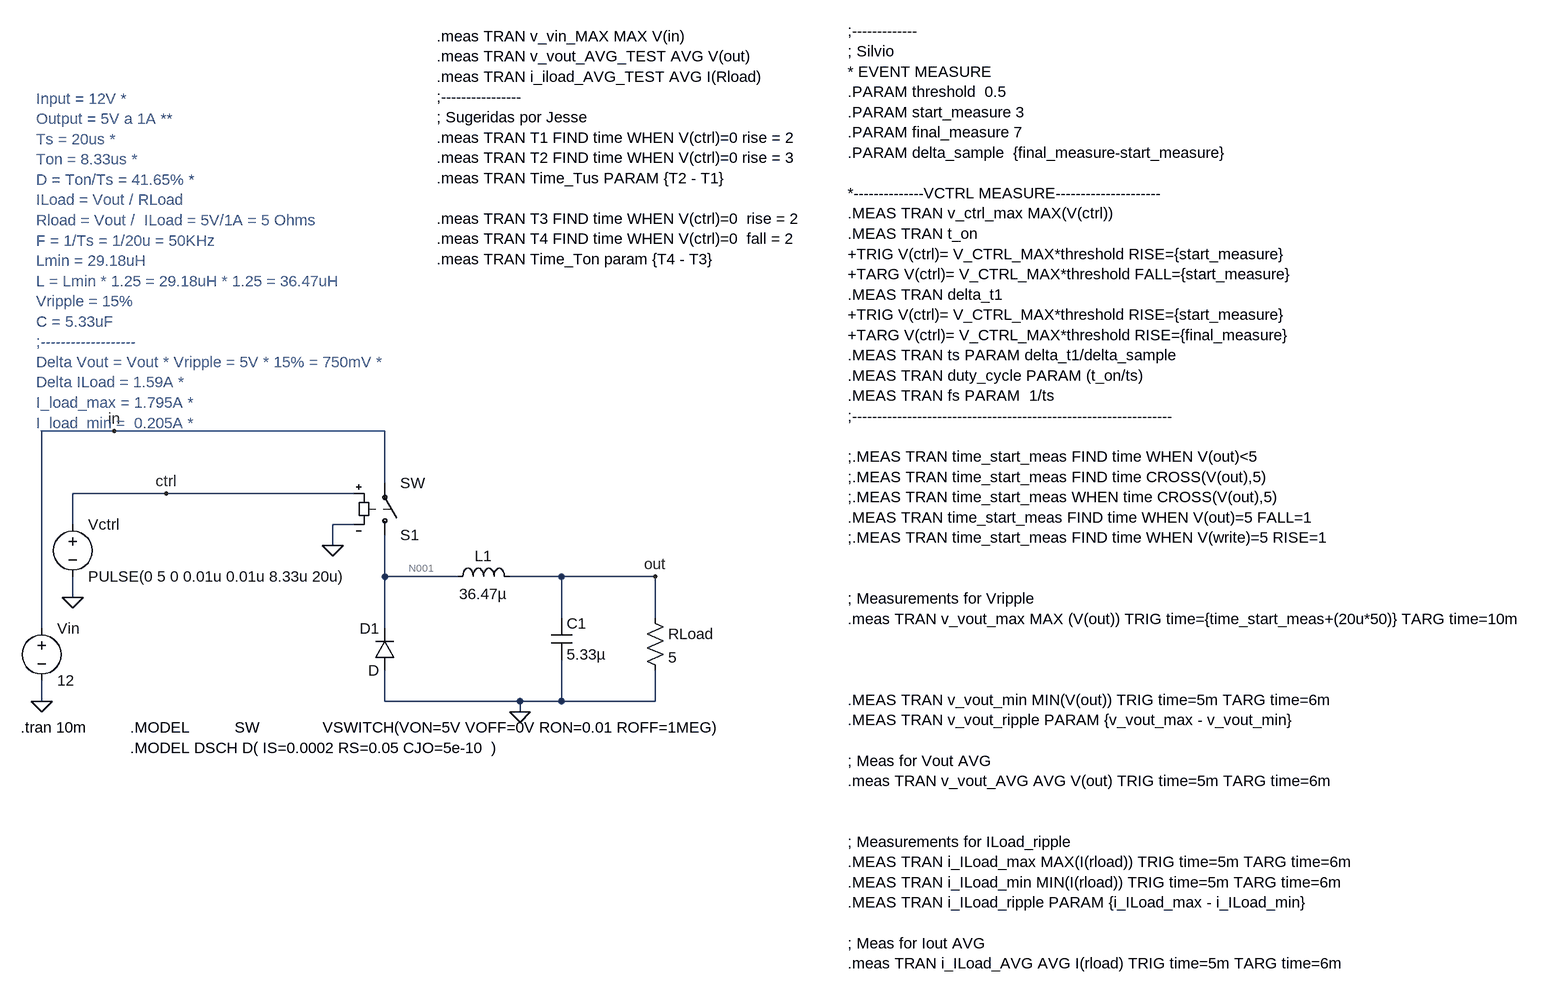
[diagram p0: schematic Buck_Converter_Learning.asc]
Buck_Converter_Learning.asc, the LTspice schematic file:
Version 4
SHEET 1 2132 820
WIRE -160 -144 -272 -144
WIRE 256 -144 -160 -144
WIRE 256 -64 256 -144
WIRE -80 -48 -224 -48
WIRE 208 -48 -80 -48
WIRE -224 0 -224 -48
WIRE 208 0 176 0
WIRE 176 32 176 0
WIRE 256 80 256 16
WIRE 368 80 256 80
WIRE 528 80 448 80
WIRE 672 80 528 80
WIRE -224 112 -224 80
WIRE 528 144 528 80
WIRE 672 144 672 80
WIRE -272 160 -272 -144
WIRE 256 160 256 80
WIRE -272 272 -272 240
WIRE 256 272 256 224
WIRE 464 272 256 272
WIRE 528 272 528 208
WIRE 528 272 464 272
WIRE 672 272 672 224
WIRE 672 272 528 272
WIRE 464 288 464 272
FLAG -272 272 0
FLAG 464 288 0
FLAG -224 112 0
FLAG 176 32 0
FLAG -160 -144 in
FLAG 672 80 out
FLAG -80 -48 ctrl
SYMBOL voltage -272 144 R0
WINDOW 123 0 0 Left 0
WINDOW 39 0 0 Left 0
SYMATTR InstName Vin
SYMATTR Value 12
SYMBOL sw 256 32 M180
SYMATTR InstName S1
SYMBOL diode 272 224 R180
WINDOW 0 24 64 Left 2
WINDOW 3 24 0 Left 2
SYMATTR InstName D1
SYMBOL ind 352 96 R270
WINDOW 0 32 56 VTop 2
WINDOW 3 5 56 VBottom 2
SYMATTR InstName L1
SYMATTR Value 36.47µ
SYMBOL cap 512 144 R0
SYMATTR InstName C1
SYMATTR Value 5.33µ
SYMBOL res 656 128 R0
SYMATTR InstName RLoad
SYMATTR Value 5
SYMBOL voltage -224 -16 R0
WINDOW 123 0 0 Left 0
WINDOW 39 0 0 Left 0
SYMATTR InstName Vctrl
SYMATTR Value PULSE(0 5 0 0.01u 0.01u 8.33u 20u)
TEXT -280 -656 Left 2 ;Input = 12V *\nOutput = 5V a 1A **\nTs = 20us *            \nTon = 8.33us *\nD = Ton/Ts = 41.65% *\nILoad = Vout / RLoad\nRload = Vout /  ILoad = 5V/1A = 5 Ohms\nF = 1/Ts = 1/20u = 50KHz\nLmin = 29.18uH\nL = Lmin * 1.25 = 29.18uH * 1.25 = 36.47uH\nVripple = 15%\nC = 5.33uF\n;-------------------\nDelta Vout = Vout * Vripple = 5V * 15% = 750mV *\nDelta ILoad = 1.59A *\nI_load_max = 1.795A *\nI_load_min =  0.205A *
TEXT -304 312 Left 2 !.tran 10m
TEXT -136 312 Left 2 !.MODEL          SW              VSWITCH(VON=5V VOFF=0V RON=0.01 ROFF=1MEG)\n.MODEL DSCH D( IS=0.0002 RS=0.05 CJO=5e-10  )
TEXT 336 -752 Left 2 !.meas TRAN v_vin_MAX MAX V(in)\n.meas TRAN v_vout_AVG_TEST AVG V(out)\n.meas TRAN i_iload_AVG_TEST AVG I(Rload)\n;----------------\n; Sugeridas por Jesse\n.meas TRAN T1 FIND time WHEN V(ctrl)=0 rise = 2\n.meas TRAN T2 FIND time WHEN V(ctrl)=0 rise = 3\n.meas TRAN Time_Tus PARAM {T2 - T1}\n \n.meas TRAN T3 FIND time WHEN V(ctrl)=0  rise = 2\n.meas TRAN T4 FIND time WHEN V(ctrl)=0  fall = 2\n.meas TRAN Time_Ton param {T4 - T3}
TEXT 968 -760 Left 2 !;-------------\n; Silvio\n* EVENT MEASURE\n.PARAM threshold  0.5\n.PARAM start_measure 3\n.PARAM final_measure 7\n.PARAM delta_sample  {final_measure-start_measure}\n \n*--------------VCTRL MEASURE---------------------\n.MEAS TRAN v_ctrl_max MAX(V(ctrl))\n.MEAS TRAN t_on\n+TRIG V(ctrl)= V_CTRL_MAX*threshold RISE={start_measure}\n+TARG V(ctrl)= V_CTRL_MAX*threshold FALL={start_measure}\n.MEAS TRAN delta_t1\n+TRIG V(ctrl)= V_CTRL_MAX*threshold RISE={start_measure}\n+TARG V(ctrl)= V_CTRL_MAX*threshold RISE={final_measure}\n.MEAS TRAN ts PARAM delta_t1/delta_sample\n.MEAS TRAN duty_cycle PARAM (t_on/ts)\n.MEAS TRAN fs PARAM  1/ts\n;----------------------------------------------------------------\n \n;.MEAS TRAN time_start_meas FIND time WHEN V(out)<5\n;.MEAS TRAN time_start_meas FIND time CROSS(V(out),5)\n;.MEAS TRAN time_start_meas WHEN time CROSS(V(out),5)\n.MEAS TRAN time_start_meas FIND time WHEN V(out)=5 FALL=1\n;.MEAS TRAN time_start_meas FIND time WHEN V(write)=5 RISE=1\n \n \n; Measurements for Vripple\n.meas TRAN v_vout_max MAX (V(out)) TRIG time={time_start_meas+(20u*50)} TARG time=10m\n \n \n \n.MEAS TRAN v_vout_min MIN(V(out)) TRIG time=5m TARG time=6m\n.MEAS TRAN v_vout_ripple PARAM {v_vout_max - v_vout_min}\n \n; Meas for Vout AVG\n.meas TRAN v_vout_AVG AVG V(out) TRIG time=5m TARG time=6m\n \n \n; Measurements for ILoad_ripple\n.MEAS TRAN i_ILoad_max MAX(I(rload)) TRIG time=5m TARG time=6m\n.MEAS TRAN i_ILoad_min MIN(I(rload)) TRIG time=5m TARG time=6m\n.MEAS TRAN i_ILoad_ripple PARAM {i_ILoad_max - i_ILoad_min}\n \n; Meas for Iout AVG\n.meas TRAN i_ILoad_AVG AVG I(rload) TRIG time=5m TARG time=6m

The netlist it stands for:
* Buck_Converter_Learning.asc
Vin in 0 12
S1 N001 in ctrl 0 SW
D1 0 N001 D
L1 N001 out 36.47µ
C1 out 0 5.33µ
RLoad out 0 5
Vctrl ctrl 0 PULSE(0 5 0 0.01u 0.01u 8.33u 20u)
.model D D
.lib standard.dio
* Input = 12V *
* Output = 5V a 1A **
* Ts = 20us *
* Ton = 8.33us *
* D = Ton/Ts = 41.65% *
* ILoad = Vout / RLoad
* Rload = Vout /  ILoad = 5V/1A = 5 Ohms
* F = 1/Ts = 1/20u = 50KHz
* Lmin = 29.18uH
* L = Lmin * 1.25 = 29.18uH * 1.25 = 36.47uH
* Vripple = 15%
* C = 5.33uF
* ;-------------------
* Delta Vout = Vout * Vripple = 5V * 15% = 750mV *
* Delta ILoad = 1.59A *
* I_load_max = 1.795A *
* I_load_min =  0.205A *
.tran 10m
.MODEL          SW              VSWITCH(VON=5V VOFF=0V RON=0.01 ROFF=1MEG)
.MODEL DSCH D( IS=0.0002 RS=0.05 CJO=5e-10  )
.meas TRAN v_vin_MAX MAX V(in)
.meas TRAN v_vout_AVG_TEST AVG V(out)
.meas TRAN i_iload_AVG_TEST AVG I(Rload)
;----------------
; Sugeridas por Jesse
.meas TRAN T1 FIND time WHEN V(ctrl)=0 rise = 2
.meas TRAN T2 FIND time WHEN V(ctrl)=0 rise = 3
.meas TRAN Time_Tus PARAM {T2 - T1}
.meas TRAN T3 FIND time WHEN V(ctrl)=0  rise = 2
.meas TRAN T4 FIND time WHEN V(ctrl)=0  fall = 2
.meas TRAN Time_Ton param {T4 - T3}
;-------------
; Silvio
* EVENT MEASURE
.PARAM threshold  0.5
.PARAM start_measure 3
.PARAM final_measure 7
.PARAM delta_sample  {final_measure-start_measure}
*--------------VCTRL MEASURE---------------------
.MEAS TRAN v_ctrl_max MAX(V(ctrl))
.MEAS TRAN t_on
+TRIG V(ctrl)= V_CTRL_MAX*threshold RISE={start_measure}
+TARG V(ctrl)= V_CTRL_MAX*threshold FALL={start_measure}
.MEAS TRAN delta_t1
+TRIG V(ctrl)= V_CTRL_MAX*threshold RISE={start_measure}
+TARG V(ctrl)= V_CTRL_MAX*threshold RISE={final_measure}
.MEAS TRAN ts PARAM delta_t1/delta_sample
.MEAS TRAN duty_cycle PARAM (t_on/ts)
.MEAS TRAN fs PARAM  1/ts
;----------------------------------------------------------------
;.MEAS TRAN time_start_meas FIND time WHEN V(out)<5
;.MEAS TRAN time_start_meas FIND time CROSS(V(out),5)
;.MEAS TRAN time_start_meas WHEN time CROSS(V(out),5)
.MEAS TRAN time_start_meas FIND time WHEN V(out)=5 FALL=1
;.MEAS TRAN time_start_meas FIND time WHEN V(write)=5 RISE=1
; Measurements for Vripple
.meas TRAN v_vout_max MAX (V(out)) TRIG time={time_start_meas+(20u*50)} TARG time=10m
.MEAS TRAN v_vout_min MIN(V(out)) TRIG time=5m TARG time=6m
.MEAS TRAN v_vout_ripple PARAM {v_vout_max - v_vout_min}
; Meas for Vout AVG
.meas TRAN v_vout_AVG AVG V(out) TRIG time=5m TARG time=6m
; Measurements for ILoad_ripple
.MEAS TRAN i_ILoad_max MAX(I(rload)) TRIG time=5m TARG time=6m
.MEAS TRAN i_ILoad_min MIN(I(rload)) TRIG time=5m TARG time=6m
.MEAS TRAN i_ILoad_ripple PARAM {i_ILoad_max - i_ILoad_min}
; Meas for Iout AVG
.meas TRAN i_ILoad_AVG AVG I(rload) TRIG time=5m TARG time=6m
.backanno
.end

* Results of the author's LTspice run, read from the files saved beside the schematic
* Operating Point, zero values left out:
*   V(in) = 12 V
*   V(n001) = 60.01 µV
*   V(out) = 60 µV
*   I(L1) = 12 µA
*   I(Rload) = 12 µA
*   I(S1) = 12 µA
*   I(Vin) = -12 µA
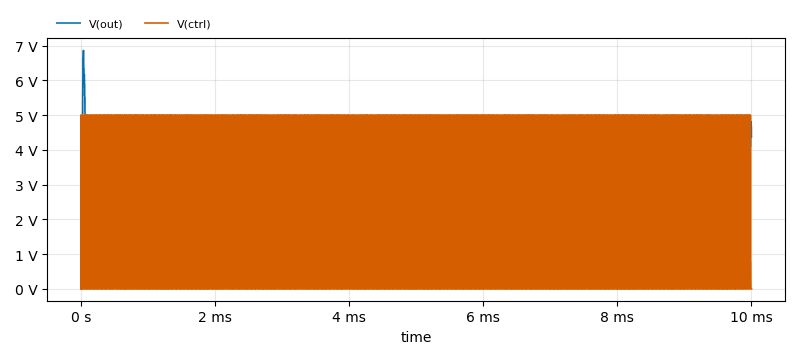
[diagram p1: Transient Analysis of Buck_Converter_Learning.asc, plotted from the saved traces]
* Transient Analysis, 1 run:
*   V(out): min 60 µV, max 6.955 V, average 4.518 V, rms 4.529 V, last 4.377 V
*   V(ctrl): min 0 V, max 5 V, average 2.085 V, rms 3.228 V, last 0 V
* From the log:
*   v_vin_max: MAX(v(in))=12 FROM 0 TO 0.01
*   v_vout_avg_test: AVG(v(out))=4.51845 FROM 0 TO 0.01
*   i_iload_avg_test: AVG(i(rload))=0.903691 FROM 0 TO 0.01
*   t1: time=2e-05 at 2e-05
*   t2: time=4e-05 at 4e-05
*   time_tus: (t2-t1)=2e-05
*   t3: time=2e-05 at 2e-05
*   t4: time=2.835e-05 at 2.835e-05
*   time_ton: (t4-t3)=8.35e-06
*   v_ctrl_max: MAX(v(ctrl))=5 FROM 0 TO 0.01
*   t_on=8.34e-06 FROM 4.0005e-05 TO 4.8345e-05
*   delta_t1=8e-05 FROM 4.0005e-05 TO 0.000120005
*   ts: delta_t1/delta_sample=2e-05
*   duty_cycle: (t_on/ts)=0.417
*   fs: 1/ts=50000
*   time_start_meas: time=5.96153e-05 at 5.96153e-05
*   v_vout_max: MAX(v(out))=4.91518 FROM 0.00105962 TO 0.01
*   v_vout_min: MIN(v(out))=4.08287 FROM 0.005 TO 0.006
*   v_vout_ripple: (v_vout_max-v_vout_min)=0.832304
*   v_vout_avg: AVG(v(out))=4.51643 FROM 0.005 TO 0.006
*   i_iload_max: MAX(i(rload))=0.982931 FROM 0.005 TO 0.006
*   i_iload_min: MIN(i(rload))=0.816574 FROM 0.005 TO 0.006
*   i_iload_ripple: (i_iload_max-i_iload_min)=0.166357
*   i_iload_avg: AVG(i(rload))=0.903286 FROM 0.005 TO 0.006